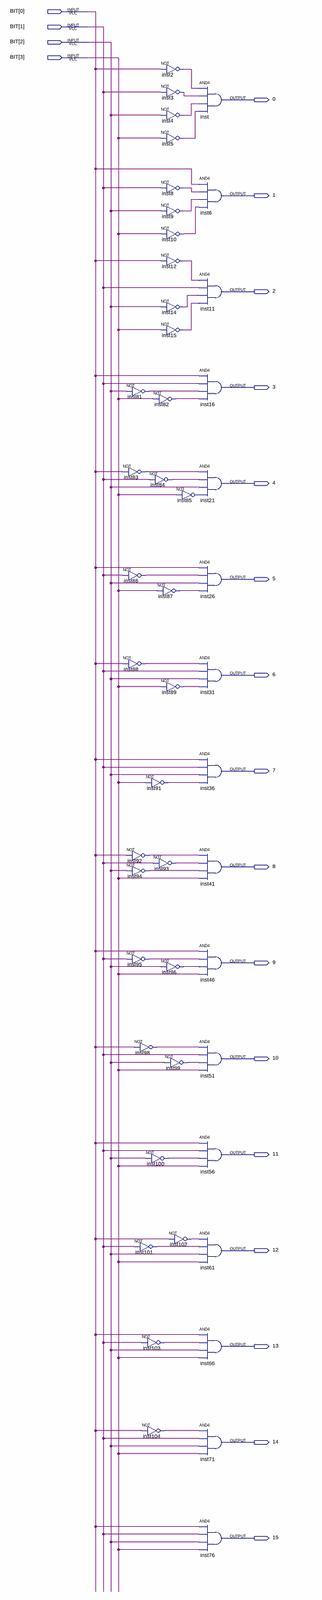
[diagram p0: schematic sheet, whole]
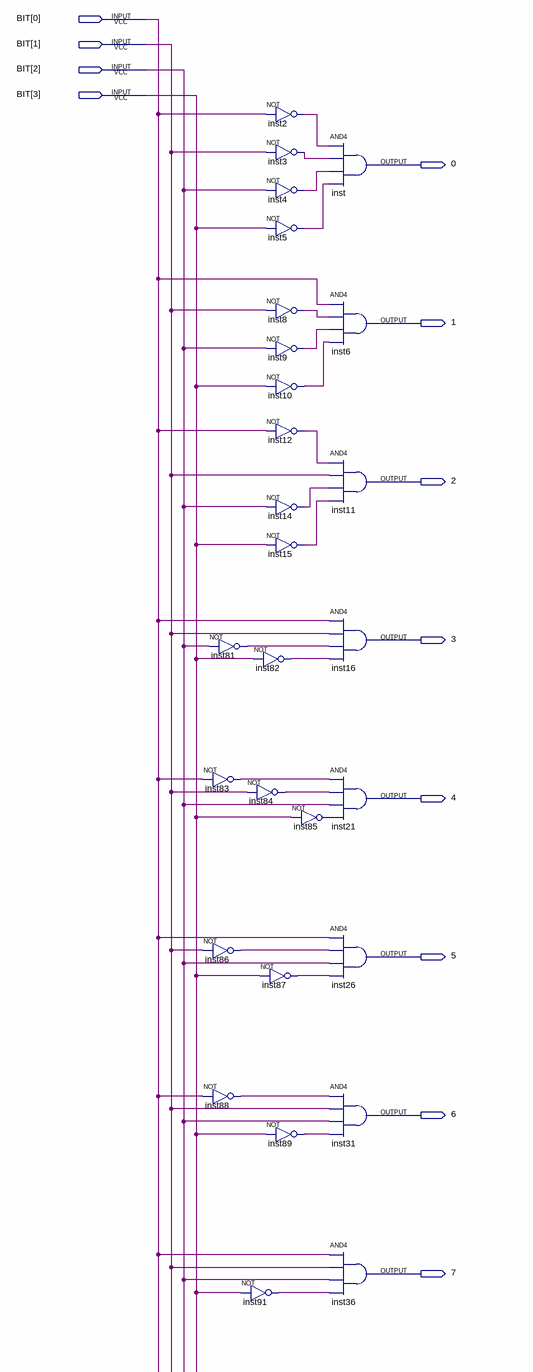
[diagram p1: schematic sheet, upper part]
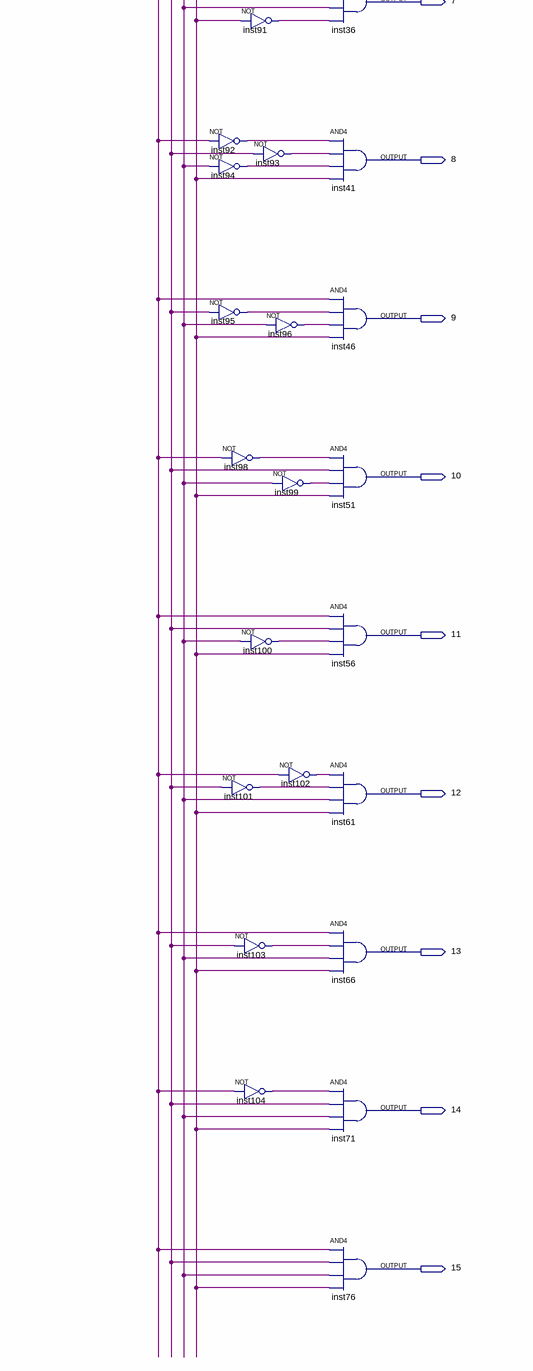
[diagram p2: schematic sheet, lower part]
// Quartus schematic binary_to_decimal.bdf as structural Verilog: 48 symbols, 20 pins
module binary_to_decimal (
  input  [3:0] BIT,
  output \0 ,
  output \1 ,
  output \2 ,
  output \3 ,
  output \4 ,
  output \5 ,
  output \6 ,
  output \7 ,
  output \8 ,
  output \9 ,
  output \10 ,
  output \11 ,
  output \12 ,
  output \13 ,
  output \14 ,
  output \15 
);

  wire inst2_out, inst3_out, inst4_out, inst5_out, inst8_out, inst9_out, inst10_out, inst12_out, inst14_out,
       inst15_out, inst81_out, inst82_out, inst83_out, inst84_out, inst85_out, inst86_out, inst87_out,
       inst88_out, inst89_out, inst91_out, inst92_out, inst93_out, inst94_out, inst95_out, inst96_out,
       inst98_out, inst99_out, inst100_out, inst101_out, inst102_out, inst103_out, inst104_out;

  not inst81 (inst81_out, BIT[2]);
  not inst83 (inst83_out, BIT[0]);
  not inst86 (inst86_out, BIT[1]);
  not inst88 (inst88_out, BIT[0]);
  not inst91 (inst91_out, BIT[3]);
  not inst92 (inst92_out, BIT[0]);
  not inst94 (inst94_out, BIT[2]);
  not inst95 (inst95_out, BIT[1]);
  not inst98 (inst98_out, BIT[0]);
  not inst100 (inst100_out, BIT[2]);
  not inst101 (inst101_out, BIT[1]);
  not inst103 (inst103_out, BIT[1]);
  not inst104 (inst104_out, BIT[0]);
  not inst2 (inst2_out, BIT[0]);
  not inst3 (inst3_out, BIT[1]);
  not inst4 (inst4_out, BIT[2]);
  not inst5 (inst5_out, BIT[3]);
  not inst8 (inst8_out, BIT[1]);
  not inst9 (inst9_out, BIT[2]);
  not inst10 (inst10_out, BIT[3]);
  not inst12 (inst12_out, BIT[0]);
  not inst14 (inst14_out, BIT[2]);
  not inst15 (inst15_out, BIT[3]);
  not inst82 (inst82_out, BIT[3]);
  not inst84 (inst84_out, BIT[1]);
  not inst85 (inst85_out, BIT[3]);
  not inst87 (inst87_out, BIT[3]);
  not inst89 (inst89_out, BIT[3]);
  not inst93 (inst93_out, BIT[1]);
  not inst96 (inst96_out, BIT[2]);
  not inst99 (inst99_out, BIT[2]);
  not inst102 (inst102_out, BIT[0]);
  and inst (\0 , inst2_out, inst3_out, inst4_out, inst5_out);
  and inst6 (\1 , BIT[0], inst8_out, inst9_out, inst10_out);
  and inst11 (\2 , inst12_out, BIT[1], inst14_out, inst15_out);
  and inst16 (\3 , BIT[0], BIT[1], inst81_out, inst82_out);
  and inst21 (\4 , inst83_out, inst84_out, BIT[2], inst85_out);
  and inst26 (\5 , BIT[0], inst86_out, BIT[2], inst87_out);
  and inst31 (\6 , inst88_out, BIT[1], BIT[2], inst89_out);
  and inst36 (\7 , BIT[0], BIT[1], BIT[2], inst91_out);
  and inst41 (\8 , inst92_out, inst93_out, inst94_out, BIT[3]);
  and inst46 (\9 , BIT[0], inst95_out, inst96_out, BIT[3]);
  and inst51 (\10 , inst98_out, BIT[1], inst99_out, BIT[3]);
  and inst56 (\11 , BIT[0], BIT[1], inst100_out, BIT[3]);
  and inst61 (\12 , inst102_out, inst101_out, BIT[2], BIT[3]);
  and inst66 (\13 , BIT[0], inst103_out, BIT[2], BIT[3]);
  and inst71 (\14 , inst104_out, BIT[1], BIT[2], BIT[3]);
  and inst76 (\15 , BIT[0], BIT[1], BIT[2], BIT[3]);
endmodule
